# Altium project nano_ICSP_breakout.PrjPcb
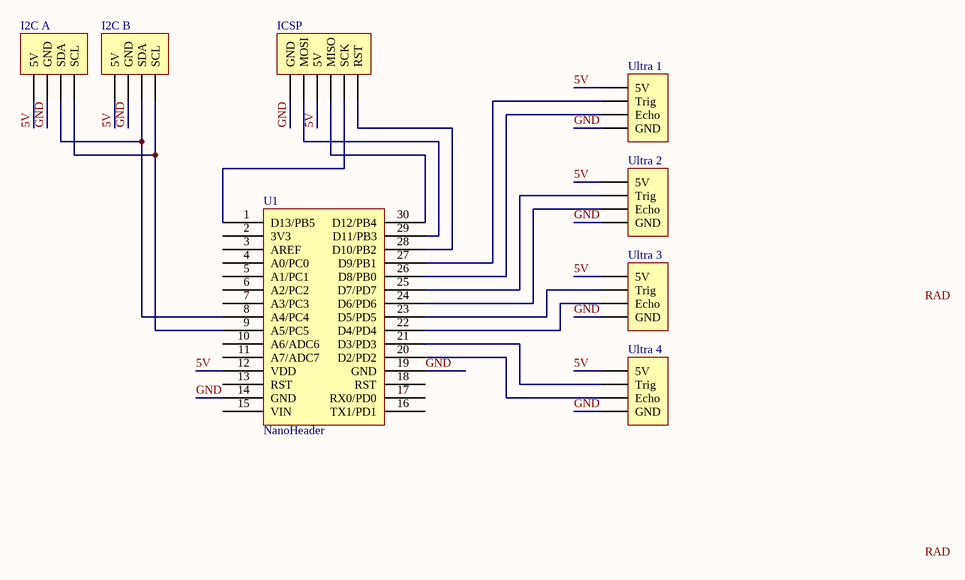
[diagram p0: ICSP_breakout.SchDoc]
1 sheet, 8 parts. Net scope: global (net labels, ports and power ports of the same name join across sheets).
Board file: ICSP_breakout.PcbDoc

## Sheet ICSP_breakout.SchDoc
size A

### Parts
I2C_A  C-Hdr1x4  [HDR1X4_LGE1.0]  (value not drawn)
I2C_B  C-Hdr1x4  [HDR1X4_LGE1.0]  (value not drawn)
ICSP  C-Hdr1x6  [HDR2X3_LGE1.0]  (value not drawn)
U1  NanoHeader  [DIP30W]
Ultra_1  C-Hdr1x4  [HDR1X4_LGE1.0]  (value not drawn)
Ultra_2  C-Hdr1x4  [HDR1X4_LGE1.0]  (value not drawn)
Ultra_3  C-Hdr1x4  [HDR1X4_LGE1.0]  (value not drawn)
Ultra_4  C-Hdr1x4  [HDR1X4_LGE1.0]  (value not drawn)

### Nets
5V: I2C_A.1(5V) I2C_B.1(5V) ICSP.1(5V) U1.12(VDD) Ultra_1.1(5V) Ultra_2.1(5V) Ultra_3.1(5V) Ultra_4.1(5V)
GND: I2C_A.2(GND) I2C_B.2(GND) ICSP.6(GND) U1.14(GND) U1.19(GND) Ultra_1.4(GND) Ultra_2.4(GND) Ultra_3.4(GND) Ultra_4.4(GND)
NetI2C_A_3: I2C_A.3(SDA) I2C_B.3(SDA) U1.8(A4/PC4)
NetI2C_A_4: I2C_A.4(SCL) I2C_B.4(SCL) U1.9(A5/PC5)
NetICSP_2: ICSP.2(MISO) U1.30(D12/PB4)
NetICSP_3: ICSP.3(MOSI) U1.29(D11/PB3)
NetICSP_4: ICSP.4(SCK) U1.1(D13/PB5)
NetICSP_5: ICSP.5(RST) U1.28(D10/PB2)
NetU1_20: U1.20(D2/PD2) Ultra_4.3(Echo)
NetU1_21: U1.21(D3/PD3) Ultra_4.2(Trig)
NetU1_22: U1.22(D4/PD4) Ultra_3.3(Echo)
NetU1_23: U1.23(D5/PD5) Ultra_3.2(Trig)
NetU1_24: U1.24(D6/PD6) Ultra_2.3(Echo)
NetU1_25: U1.25(D7/PD7) Ultra_2.2(Trig)
NetU1_26: U1.26(D8/PB0) Ultra_1.3(Echo)
NetU1_27: U1.27(D9/PB1) Ultra_1.2(Trig)

Not connected (* = marked no-connect by the designer): U1 2(3V3) 3(AREF) 4(A0/PC0) 5(A1/PC1) 6(A2/PC2) 7(A3/PC3) 10(A6/ADC6) 11(A7/ADC7) 13(RST) 15(VIN) 16(TX1/PD1) 17(RX0/PD0) 18(RST)

### Notes on the sheet
- Labels drawn without touching a wire or pin: RAD

### Library data of the parts
I2C_A I2C_B Ultra_1-Ultra_4 = C-Hdr1x4: Header, 4-Pin; LatestRevisionDate: 17-Jul-2002; LatestRevisionNote: Re-released for DXP Platform.; Publisher: Altium Limited
ICSP = C-Hdr1x6: Header, 6-Pin; LatestRevisionDate: 17-Jul-2002; LatestRevisionNote: Re-released for DXP Platform.; Publisher: Altium Limited